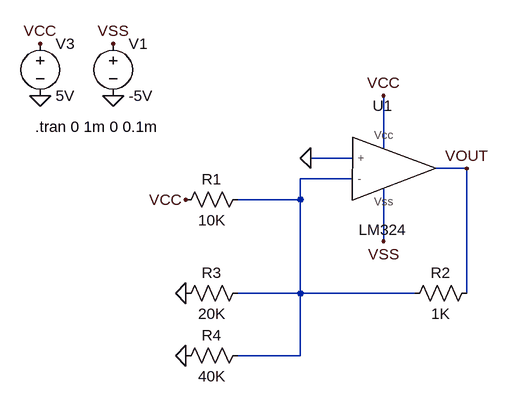
[diagram p0: schematic BAI 8 THUC HANH 1.asc]
BAI 8 THUC HANH 1.asc, the LTspice schematic file:
Version 4.1
SHEET 1 880 680
WIRE 512 64 512 -16
WIRE 464 80 400 80
WIRE 640 96 592 96
WIRE 464 112 384 112
WIRE 384 144 384 112
WIRE 384 144 288 144
WIRE 512 208 512 128
WIRE 384 288 384 144
WIRE 384 288 288 288
WIRE 560 288 384 288
WIRE 640 288 640 96
WIRE 384 384 384 288
WIRE 384 384 288 384
FLAG -16 -16 0
FLAG -16 -96 VCC
FLAG 96 -96 VSS
FLAG 96 -16 0
FLAG 400 80 0
FLAG 512 -16 VCC
FLAG 208 144 VCC
FLAG 208 288 0
FLAG 208 384 0
FLAG 512 208 VSS
FLAG 640 96 VOUT
SYMBOL voltage -16 -112 R0
SYMATTR InstName V3
SYMATTR Value 5V
SYMBOL voltage 96 -112 R0
SYMATTR InstName V1
SYMATTR Value -5V
SYMBOL LM324 512 96 R0
SYMATTR InstName U1
SYMBOL res 304 128 R90
WINDOW 0 0 56 VBottom 2
WINDOW 3 32 56 VTop 2
SYMATTR InstName R1
SYMATTR Value 10K
SYMBOL res 304 272 R90
WINDOW 0 0 56 VBottom 2
WINDOW 3 32 56 VTop 2
SYMATTR InstName R3
SYMATTR Value 20K
SYMBOL res 304 368 R90
WINDOW 0 0 56 VBottom 2
WINDOW 3 32 56 VTop 2
SYMATTR InstName R4
SYMATTR Value 40K
SYMBOL res 656 272 R90
WINDOW 0 0 56 VBottom 2
WINDOW 3 32 56 VTop 2
SYMATTR InstName R2
SYMATTR Value 1K
TEXT -24 32 Left 2 !.tran 0 1m 0 0.1m

The netlist it stands for:
* BAI 8 THUC HANH 1.asc
V3 VCC 0 5V
V1 VSS 0 -5V
X§U1 0 N001 VCC VSS VOUT LM324  ; pins + - Vcc Vss ?
R1 N001 VCC 10K
R3 N001 0 20K
R4 N001 0 40K
R2 VOUT N001 1K
.tran 0 1m 0 0.1m
.lib E:\ThiThucHanhCoHa\CoHa\LM324.cir
.backanno
.end